# Altium schematic sheet 13-I225_2.SchDoc
size B; SheetNumber: 13; SheetTotal: 13
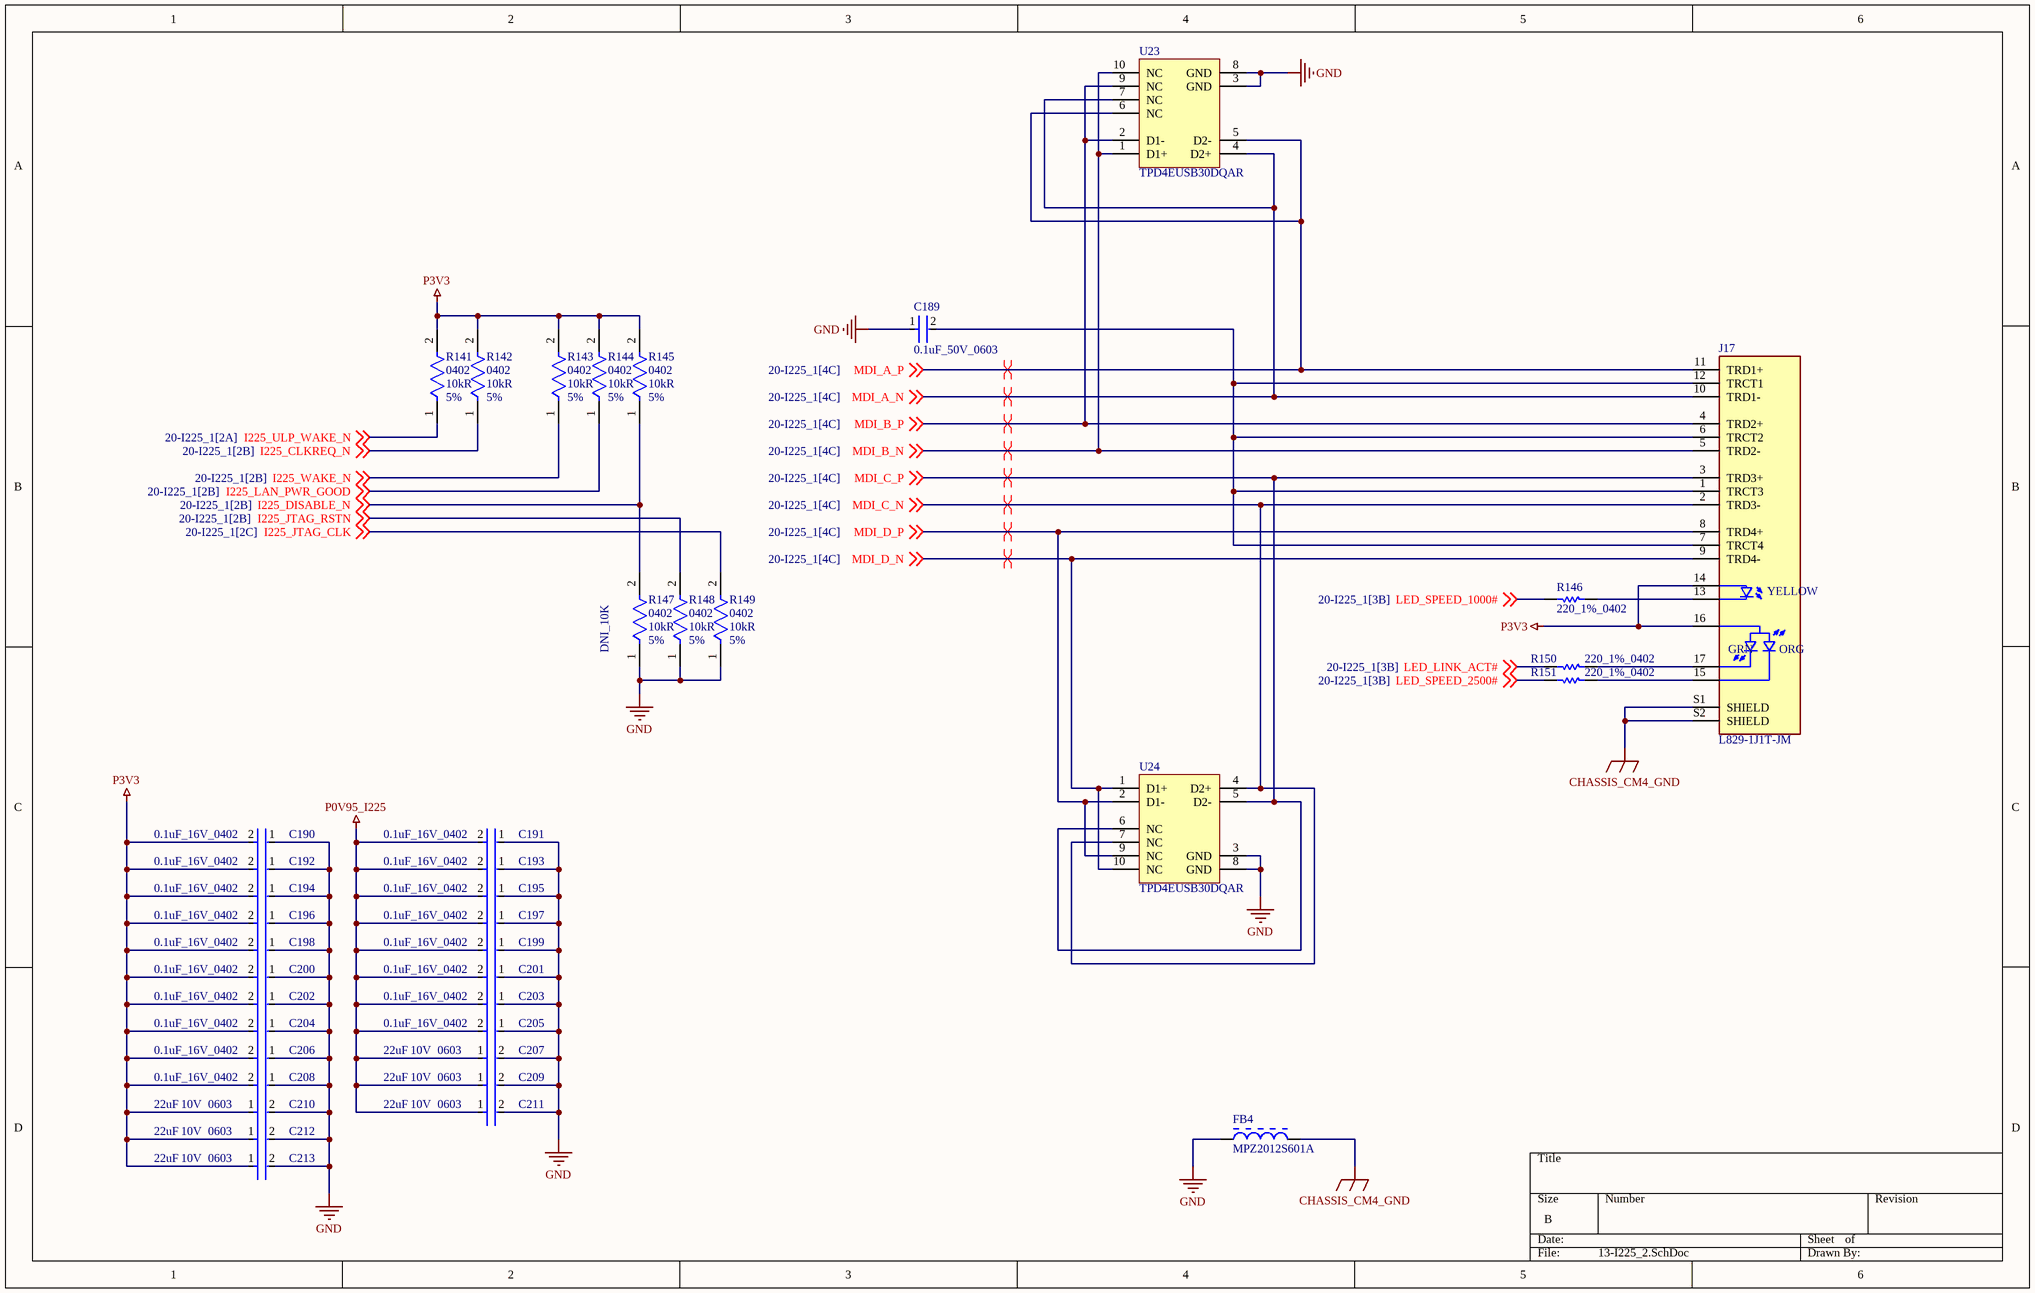
[diagram p0: 13-I225_2.SchDoc]

## Parts
C189  0.1uF_50V_0603  [FP-C0603-CJ-MFG]
C190  0.1uF_16V_0402  [FP-GRM15-MFG]
C191  0.1uF_16V_0402  [FP-GRM15-MFG]
C192  0.1uF_16V_0402  [FP-GRM15-MFG]
C193  0.1uF_16V_0402  [FP-GRM15-MFG]
C194  0.1uF_16V_0402  [FP-GRM15-MFG]
C195  0.1uF_16V_0402  [FP-GRM15-MFG]
C196  0.1uF_16V_0402  [FP-GRM15-MFG]
C197  0.1uF_16V_0402  [FP-GRM15-MFG]
C198  0.1uF_16V_0402  [FP-GRM15-MFG]
C199  0.1uF_16V_0402  [FP-GRM15-MFG]
C200  0.1uF_16V_0402  [FP-GRM15-MFG]
C201  0.1uF_16V_0402  [FP-GRM15-MFG]
C202  0.1uF_16V_0402  [FP-GRM15-MFG]
C203  0.1uF_16V_0402  [FP-GRM15-MFG]
C204  0.1uF_16V_0402  [FP-GRM15-MFG]
C205  0.1uF_16V_0402  [FP-GRM15-MFG]
C206  0.1uF_16V_0402  [FP-GRM15-MFG]
C207  Capacitance: 22uF  Voltage Rating: 10V  Case Code (Imperial): 0603  [FP-GRM188-0_2-IPC_C]  (hidden comment: GRM188R61A226ME15D)
C208  0.1uF_16V_0402  [FP-GRM15-MFG]
C209  Capacitance: 22uF  Voltage Rating: 10V  Case Code (Imperial): 0603  [FP-GRM188-0_2-IPC_C]  (hidden comment: GRM188R61A226ME15D)
C210  Capacitance: 22uF  Voltage Rating: 10V  Case Code (Imperial): 0603  [FP-GRM188-0_2-IPC_C]  (hidden comment: GRM188R61A226ME15D)
C211  Capacitance: 22uF  Voltage Rating: 10V  Case Code (Imperial): 0603  [FP-GRM188-0_2-IPC_C]  (hidden comment: GRM188R61A226ME15D)
C212  Capacitance: 22uF  Voltage Rating: 10V  Case Code (Imperial): 0603  [FP-GRM188-0_2-IPC_C]  (hidden comment: GRM188R61A226ME15D)
C213  Capacitance: 22uF  Voltage Rating: 10V  Case Code (Imperial): 0603  [FP-GRM188-0_2-IPC_C]  (hidden comment: GRM188R61A226ME15D)
FB4  MPZ2012S601A  [TDK-MPZ2012_V]
J17  L829-1J1T-JM  [BEL_L829-1J1T-JM]
R141  Case/Package: 0402  Resistance: 10kR  Tolerance: 5%  [FP-CRCW0402-e3-IPC_B]  (hidden comment: CRCW040210K0JNED)
R142  Case/Package: 0402  Resistance: 10kR  Tolerance: 5%  [FP-CRCW0402-e3-IPC_B]  (hidden comment: CRCW040210K0JNED)
R143  Case/Package: 0402  Resistance: 10kR  Tolerance: 5%  [FP-CRCW0402-e3-IPC_B]  (hidden comment: CRCW040210K0JNED)
R144  Case/Package: 0402  Resistance: 10kR  Tolerance: 5%  [FP-CRCW0402-e3-IPC_B]  (hidden comment: CRCW040210K0JNED)
R145  Case/Package: 0402  Resistance: 10kR  Tolerance: 5%  [FP-CRCW0402-e3-IPC_B]  (hidden comment: CRCW040210K0JNED)
R146  220_1%_0402  [RESC1005X40X25LL10T10]
R147  DNI_10K  Case/Package: 0402  Resistance: 10kR  Tolerance: 5%  [FP-CRCW0402-e3-IPC_B]  (no BOM)
R148  Case/Package: 0402  Resistance: 10kR  Tolerance: 5%  [FP-CRCW0402-e3-IPC_B]  (hidden comment: CRCW040210K0JNED)
R149  Case/Package: 0402  Resistance: 10kR  Tolerance: 5%  [FP-CRCW0402-e3-IPC_B]  (hidden comment: CRCW040210K0JNED)
R150  220_1%_0402  [RESC1005X40X25LL10T10]
R151  220_1%_0402  [RESC1005X40X25LL10T10]
U23  TPD4EUSB30DQAR  [DQA0010A_V]
U24  TPD4EUSB30DQAR  [DQA0010A_V]

## Nets
CHASSIS_CM4_GND: FB4.2 J17.S1(SHIELD) J17.S2(SHIELD)
GND: C189.1 C190.1 C191.1 C192.1 C193.1 C194.1 C195.1 C196.1 C197.1 C198.1 C199.1 C200.1 C201.1 C202.1 C203.1 C204.1 C205.1 C206.1 C207.2 C208.1 C209.2 C210.2 C211.2 C212.2 C213.2 FB4.1 R147.1 R148.1 R149.1 U23.3(GND) U23.8(GND) U24.3(GND) U24.8(GND)
P0V95_I225: C191.2 C193.2 C195.2 C197.2 C199.2 C201.2 C203.2 C205.2 C207.1 C209.1 C211.1
P3V3: C190.2 C192.2 C194.2 C196.2 C198.2 C200.2 C202.2 C204.2 C206.2 C208.2 C210.1 C212.1 C213.1 J17.14(YA_1) J17.16(CA) R141.2 R142.2 R143.2 R144.2 R145.2
I225_CLKREQ_N: R142.1 ; off-sheet I225_CLKREQ_N
I225_DISABLE_N: R145.1 R147.2 ; off-sheet I225_DISABLE_N
I225_JTAG_CLK: R149.2 ; off-sheet I225_JTAG_CLK
I225_JTAG_RSTN: R148.2 ; off-sheet I225_JTAG_RSTN
I225_LAN_PWR_GOOD: R144.1 ; off-sheet I225_LAN_PWR_GOOD
I225_ULP_WAKE_N: R141.1 ; off-sheet I225_ULP_WAKE_N
I225_WAKE_N: R143.1 ; off-sheet I225_WAKE_N
LED_LINK_ACT#: R150.2 ; off-sheet LED_LINK_ACT#
LED_SPEED_1000#: R146.2 ; off-sheet LED_SPEED_1000#
LED_SPEED_2500#: R151.2 ; off-sheet LED_SPEED_2500#
MDI_A_N: J17.10(TRD1-) U23.4(D2+) U23.7(NC) ; off-sheet MDI_A_N
MDI_A_P: J17.11(TRD1+) U23.5(D2-) U23.6(NC) ; off-sheet MDI_A_P
MDI_B_N: J17.5(TRD2-) U23.1(D1+) U23.10(NC) ; off-sheet MDI_B_N
MDI_B_P: J17.4(TRD2+) U23.2(D1-) U23.9(NC) ; off-sheet MDI_B_P
MDI_C_N: J17.2(TRD3-) U24.4(D2+) U24.7(NC) ; off-sheet MDI_C_N
MDI_C_P: J17.3(TRD3+) U24.5(D2-) U24.6(NC) ; off-sheet MDI_C_P
MDI_D_N: J17.9(TRD4-) U24.1(D1+) U24.10(NC) ; off-sheet MDI_D_N
MDI_D_P: J17.8(TRD4+) U24.2(D1-) U24.9(NC) ; off-sheet MDI_D_P
NetC189_2: C189.2 J17.1(TRCT3) J17.6(TRCT2) J17.7(TRCT4) J17.12(TRCT1)
NetJ17_13: J17.13(YK_1) R146.1
NetJ17_15: J17.15(OK_1) R151.1
NetJ17_17: J17.17(GK_1) R150.1

## Layout directives
differential pair: MDI_A_N, MDI_A_P, MDI_B_N, MDI_B_P, MDI_C_N, MDI_C_P, MDI_D_N, MDI_D_P

## Notes on the sheet
- (in symbol L829-1J1T-JM) YELLOW; GRN; ORG

## Library data of the parts
C189 = CMP-2006-03300-2: CAP CER 0.1UF 50V X7R 0603; Manufacturer Part Number: C0603X104K5RACTU; Manufacturer: Kemet; Capacitance: 100nF; Material: Ceramic; Tolerance: 10%; Value: 100nF; Temperature Coefficient: 15%; Temperature Range High: +125°C; Temperature Range Low: -55°C; Voltage: 50V; ComponentLink2Description: Datasheet; RoHS: TRUE; ComponentLink2URL: https://content.kemet.com/datasheets/KEM_C1013_X7R_FT-CAP_SMD.pdf; Device Class L3: Ceramic Capacitors; Device Class L2: Capacitors; Package: C0603-CJ; Height: 0.95mm; Device Class L1: Passive Components; Temperature Characteristic: X7R; Lead Free: Yes; Digikey Description: CAP CER 0.1UF 50V X7R 0603; Automotive: No; Mouser Description: Capacitor; Ceramic; Cap 0.1uF; Tol+10%; SMT; Flexible Termination; Vol-Rtg 50V; TR; Temperature: -55°C to +125°C; Octopart: https://octopart.com/c0603x104k5ractu-kemet-9145062; Category: Cap; Voltage Rating: 50V; Ipc Land Pattern Name: CAPC16080X80
C190-C206 C208 = CMP-2100-03641-2: CAP CER 0.1UF 16V X7R 0402; Manufacturer Part Number: GRM155R71C104KA88D; Manufacturer: Murata; Standoff Height: 0mm; Tolerance: 10%; Voltage Rating: 16Vdc; Material: Ceramic; Capacitance: 0.10μF; Value: 0.10μF; RoHS: TRUE; Temperature Characteristic: X7R; Octopart: https://octopart.com/grm155r71c104ka88d-murata-196880; Digikey Description: CAP CER 0.1UF 16V X7R 0402; Device Class L3: Ceramic Capacitors; Height: 0.55mm; ComponentLink2Description: Datasheet; Temperature Range Low: -55°C; Ipc Land Pattern Name: CAPC10050X219; ComponentLink2URL: https://search.murata.co.jp/Ceramy/image/img/A01X/G101/ENG/GRM155R71H471KA01-01A.pdf; Device Class L1: Passive Components; Lead Free: yes; Category: Cap; Package: GRM15; Temperature: -55°C to +125°C; Device Class L2: Capacitors; Temperature Range High: +125°C; Mouser Description: 0402 0.1 uF 16V ±10 % Tolerance X7R SMT Multilayer Ceramic Capacitor
C207 C209-C213 = CMP-2000-06337-3: Chip Multilayer Ceramic Capacitors for General Purpose, 0603, 22uF, X5R, 15%, 20%, 10V; Tolerance: 20%; Weight: 0.000222oz; Material: Ceramic; Depth: 0.8mm; Length: 1.6mm; Termination: SMD/SMT; Packaging: Tape and Reel; Width: 0.8mm; Mount: Surface Mount; Voltage Rating (DC): 10V; Case/Package: 0603; Thickness: 0.039inch; REACH SVHC: No SVHC; Dielectric: X5R; Height: 0.8mm; Package Quantity: 4000; Case Code (Metric): 1608; Min Operating Temperature: -55°C; Lead Free: Lead Free; Max Operating Temperature: 85°C
FB4 = CMP-2000-05400-1: Chip Bead for Power Line, 600 Ohm, +/- 25%, 2 A, -55 to 125 degC, 2-Pin SMD (0805), RoHS, Tape and Reel; Manufacturer: TDK; Maximum DC Current: 2A; Impedance: 600Ohms; Test Frequency: 100MHz; Case Length: 2mm; Maximum DC Resistance: 100mOhms; Case Height: 0.85mm; Case Width: 1.25mm; Factory Pack Quantity: 4000; Operating Temperature Range: -55Cto+125C; Packaging: Reel; Datasheet URL: https://datasheet.ciiva.com/23763/1750041-23763249.pdf; Manufacturer URL: http://www.tdk.com/; Product Category: EMIFilterBeads,Chips&Arrays; Tolerance: 25%; Product: FerriteChipBeads; Package / Case: 0805(2012metric); RoHS: Details; Dimensions: 1.25mmWx2mmLx0.85mmH; Datasheet Version: Jul-13; Termination Style: SMD/SMT; Package Reference: 805; Brand: TDK; Package Description: 2-Pin Surface Mount Device, Body 2 x 1.25 mm
J17 = L829-1J1T-JM: MagJack 2.5GBASE-T | 1X1 | OG/Y LED | -40 to 85C | RoHS; MF: Bel Magnetic Solutions; MP: L829-1J1T-JM; DigiKey-Purchase-URL: https://snapeda.com/shop?store=DigiKey&id=2758678; SnapEDA_Link: https://www.snapeda.com/parts/L829-1J1T-JM/Bel%20Magnetic%20Solutions/view-part/2758678/?ref=snap; Digi-Key_Part_Number: 507-2068-ND; Package: None; Value: *
R141-R145 R147-R149 = CMP-2002-08136-3: RES Thick Film, 10kΩ, 5%, 0.063W, 200ppm/°C, 0402; Voltage Rating: 50V; Power Rating: 63mW; Military Standard: Not; Packaging: Tape and Reel; Case Code (Imperial): 0402; Min Operating Temperature: -55°C; Case Code (Metric): 1005; Temperature Coefficient: 200ppm/°C; Termination: SMD/SMT; Composition: Thick Film; Depth: 0.5mm; Number of Terminations: 2; Contact Plating: Tin; Height: 0.016inch; Width: 0.5mm; Max Operating Temperature: 155°C; Features: Automotive AEC-Q200; Length: 1mm; Radiation Hardening: No; Max Power Dissipation: 63mW; Mount: Surface Mount; Package Quantity: 1; Weight: 2.3E-05oz
R146 R150 R151 = CMP-2002-03891-1: Part Number: RK73H1ETTP2200F; Manufacturer: KOA Speer
U23 U24 = CMP-0326-00027-3: ESD Solution for Super-Speed (6 GBPS) USB 3.0 Interface, 4 Channels, -40 to +85 degC, 10-pin SON (DQA), Green (RoHS & no Sb/Br); Manufacturer: Texas Instruments; Differential Capacitance(pF): 0.05; Serial ATA / eSATA: TRUE; IO Capacitance(Typ)(pF): 0.8; IO Leakage Current(nA): 10; IEC 61000-4-2 Air-Gap(+/- kV): 8; ComponentLink3Description: URL Link1; PartNumber: TPD4EUSB30DQAR; DatasheetVersion: SLVSAC2C; ComponentLink2URL: http://www.ti.com/general/docs/lit/getliterature.tsp?genericPartNumber=TPD4EUSB30&fileType=pdf; USB Super Speed: TRUE; Eco-Plan: Green (RoHS & no Sb/Br); Mounting Technology: Surface Mount; 1394 / Firewire: TRUE; PackageVersion: revB, Sep-2009; SubFamily: ESD Solution; USB Full Speed: TRUE; USB High Speed: TRUE; ComponentLink2Description: Datasheet; ComponentLink1URL: http://www.ti.com/; IEC 61000-4-2 Contact(+/- kV): 8; Breakdown Voltage(Min)(V): 8; PackageReference: DQA0010A; ComponentLink1Description: Manufacturer URL; PackageDescription: 10-Pin Plastic Small Outline No-Lead, 1 x 2.5 x 0.55 mm Body, 0.5 mm Pitch; ComponentLink3URL: SamplesURL:http://www.ti.com/product/tpd4eusb30#samples; HDMI: TRUE